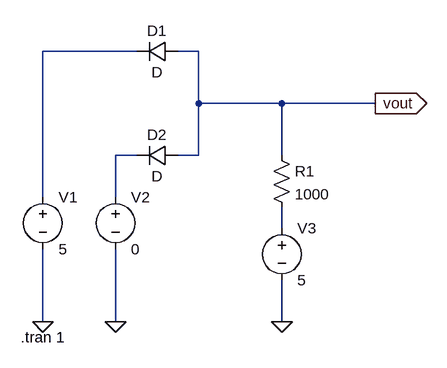
[diagram p0: schematic 1c.asc]
1c.asc, the LTspice schematic file:
Version 4
SHEET 1 880 680
WIRE 208 -80 64 -80
WIRE 304 -80 272 -80
WIRE 304 0 304 -80
WIRE 432 0 304 0
WIRE 576 0 432 0
WIRE 208 80 176 80
WIRE 304 80 304 0
WIRE 304 80 272 80
WIRE 432 80 432 0
WIRE 64 144 64 -80
WIRE 176 144 176 80
WIRE 432 192 432 160
WIRE 64 336 64 224
WIRE 176 336 176 224
WIRE 432 336 432 272
FLAG 432 336 0
FLAG 176 336 0
FLAG 64 336 0
FLAG 576 0 vout
IOPIN 576 0 Out
SYMBOL voltage 64 128 R0
WINDOW 123 0 0 Left 0
WINDOW 39 0 0 Left 0
SYMATTR InstName V1
SYMATTR Value 5
SYMBOL voltage 176 128 R0
WINDOW 123 0 0 Left 0
WINDOW 39 0 0 Left 0
SYMATTR InstName V2
SYMATTR Value 0
SYMBOL res 416 64 R0
SYMATTR InstName R1
SYMATTR Value 1000
SYMBOL voltage 432 176 R0
WINDOW 123 0 0 Left 0
WINDOW 39 0 0 Left 0
SYMATTR InstName V3
SYMATTR Value 5
SYMBOL diode 272 64 R90
WINDOW 0 0 32 VBottom 2
WINDOW 3 32 32 VTop 2
SYMATTR InstName D2
SYMBOL diode 272 -96 R90
WINDOW 0 0 32 VBottom 2
WINDOW 3 32 32 VTop 2
SYMATTR InstName D1
TEXT 30 360 Left 2 !.tran 1

The netlist it stands for:
* 1c.asc
V1 N001 0 5
V2 N002 0 0
R1 vout N003 1000
V3 N003 0 5
D2 vout N002 D
D1 vout N001 D
.model D D
.lib standard.dio
.tran 1
.backanno
.end